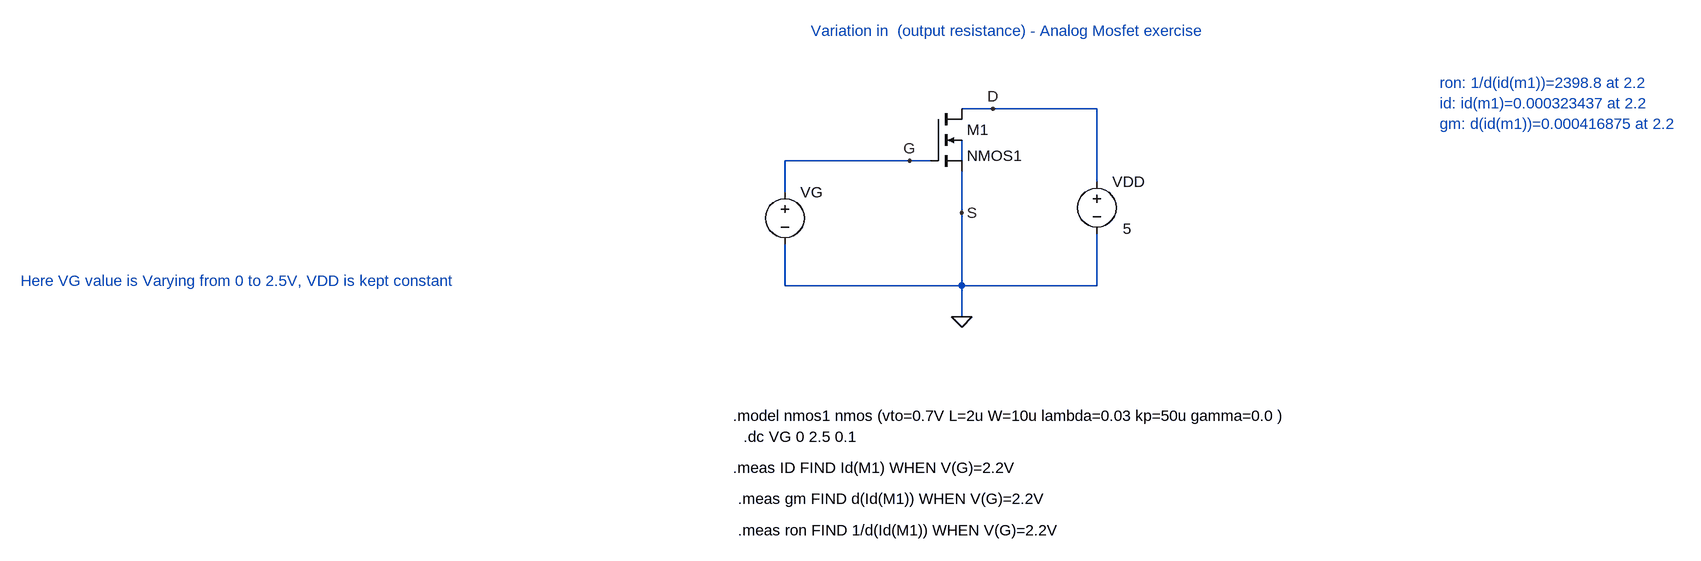
[diagram p0: schematic Variation in (mosfet) diff lambda in terms of gm.asc]
Variation in (mosfet) diff lambda in terms of gm.asc, the LTspice schematic file:
Version 4
SHEET 1 1700 840
WIRE 176 96 128 96
WIRE 336 96 176 96
WIRE 48 176 -144 176
WIRE 80 176 48 176
WIRE 128 176 128 144
WIRE 336 208 336 96
WIRE -144 224 -144 176
WIRE 128 256 128 192
WIRE -144 368 -144 304
WIRE 128 368 128 256
WIRE 128 368 -144 368
WIRE 336 368 336 288
WIRE 336 368 128 368
WIRE 128 416 128 368
FLAG 128 416 0
FLAG 176 96 D
FLAG 128 256 S
FLAG 48 176 G
SYMBOL nmos4 80 96 R0
SYMATTR InstName M1
SYMATTR Value NMOS1
SYMBOL voltage 336 192 R0
WINDOW 123 0 0 Left 0
WINDOW 39 0 0 Left 0
WINDOW 3 40 88 Left 2
SYMATTR Value 5
SYMATTR InstName VDD
SYMBOL voltage -144 208 R0
WINDOW 123 0 0 Left 0
WINDOW 39 0 0 Left 0
SYMATTR InstName VG
SYMATTR Value ""
TEXT -104 -24 Left 2 ;Variation in  (output resistance) - Analog Mosfet exercise
TEXT -224 568 Left 2 !.model nmos1 nmos (vto=0.7V L=2u W=10u lambda=0.03 kp=50u gamma=0.0 )
TEXT -1320 360 Left 2 ;Here VG value is Varying from 0 to 2.5V, VDD is kept constant
TEXT -216 744 Left 2 !.meas ron FIND 1/d(Id(M1)) WHEN V(G)=2.2V
TEXT -224 648 Left 2 !.meas ID FIND Id(M1) WHEN V(G)=2.2V
TEXT -216 696 Left 2 !.meas gm FIND d(Id(M1)) WHEN V(G)=2.2V
TEXT 864 56 Left 2 ;ron: 1/d(id(m1))=2398.8 at 2.2\nid: id(m1)=0.000323437 at 2.2\ngm: d(id(m1))=0.000416875 at 2.2
TEXT -208 600 Left 2 !.dc VG 0 2.5 0.1

The netlist it stands for:
* Variation in (mosfet) diff lambda in terms of gm.asc
M1 D G 0 N001 NMOS1
VDD D 0 5
VG G 0
.model NMOS NMOS
.model PMOS PMOS
.lib standard.mos
* Variation in  (output resistance) - Analog Mosfet exercise
.model nmos1 nmos (vto=0.7V L=2u W=10u lambda=0.03 kp=50u gamma=0.0 )
* Here VG value is Varying from 0 to 2.5V, VDD is kept constant
.meas ron FIND 1/d(Id(M1)) WHEN V(G)=2.2V
.meas ID FIND Id(M1) WHEN V(G)=2.2V
.meas gm FIND d(Id(M1)) WHEN V(G)=2.2V
* ron: 1/d(id(m1))=2398.8 at 2.2
* id: id(m1)=0.000323437 at 2.2
* gm: d(id(m1))=0.000416875 at 2.2
.dc VG 0 2.5 0.1
.backanno
.end

* Results of the author's LTspice run, read from the files saved beside the schematic
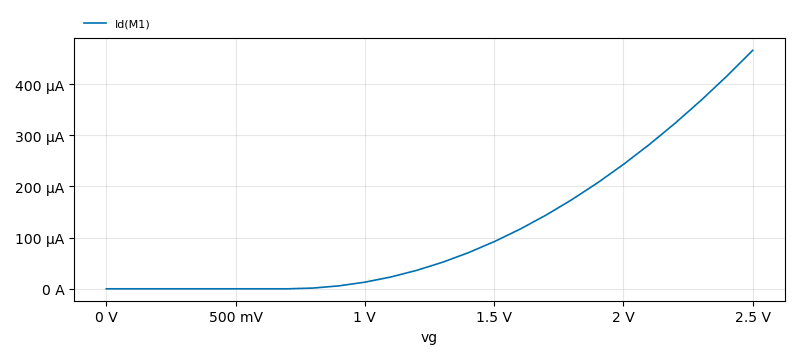
[diagram p1: DC transfer characteristic of Variation in (mosfet) diff lambda in terms of gm.asc, plotted from the saved traces]
* DC transfer characteristic, 1 run:
*   Id(M1): 9.852 pA at vg=0 V, 465.7 µA at vg=2.5 V, min 9.852 pA, max 465.7 µA
* From the log:
*   ron: 1/d(id(m1))=2398.8 at 2.2
*   id: id(m1)=0.000323437 at 2.2
*   gm: d(id(m1))=0.000416875 at 2.2